# EAGLE design i2c_rgb_smd (EAGLE 5.04)
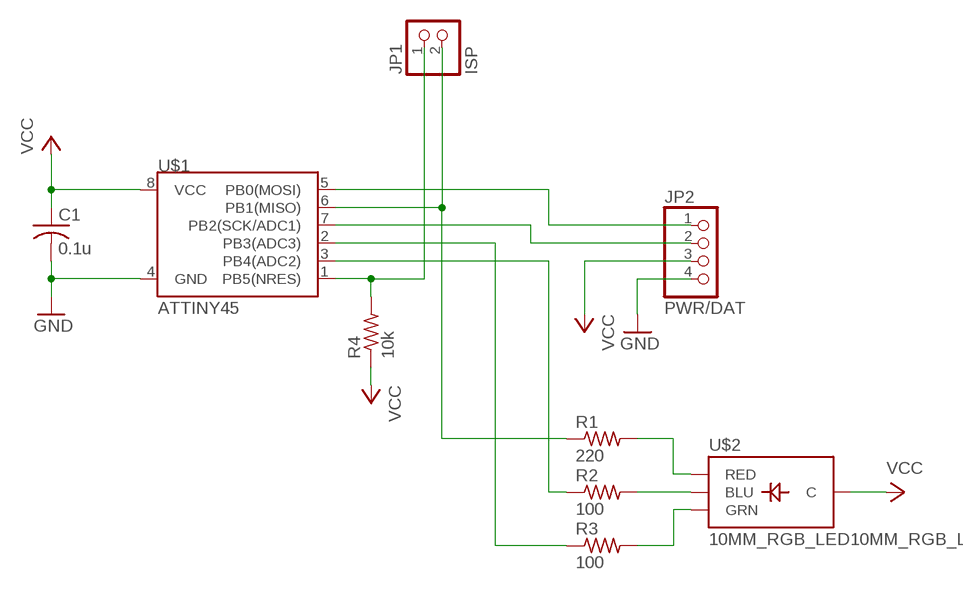
[diagram p0: schematic, sheet 1]

## Parts
C1  0.1u  C-USC0805  [C0805]
JP1  ISP  PINHD-1X2  [1X02]
JP2  PWR/DAT  PINHD-1X4  [1X04]
R1  220  R-US_R0805  [R0805]
R2  100  R-US_R0805  [R0805]
R3  100  R-US_R0805  [R0805]
R4  10k  R-US_R0805  [R0805]
U$1  ATTINY45  [SO08-EIAJ]
U$2  10MM_RGB_LED10MM_RGB_LED  [10MM_RGB_LED]

## Nets
GND [PWR]: C1.2 JP2.4 U$1.4(GND)
N$2: JP1.1 R4.2 U$1.1(PB5(NRES))
N$3: JP1.2 R1.1 U$1.6(PB1(MISO))
N$5: JP2.1 U$1.5(PB0(MOSI))
N$6: JP2.2 U$1.7(PB2(SCK/ADC1))
N$7: R1.2 U$2.RED
N$8: R2.2 U$2.BLU
N$9: R3.2 U$2.GRN
N$10: R2.1 U$1.3(PB4(ADC2))
N$11: R3.1 U$1.2(PB3(ADC3))
VCC [PWR]: C1.1 JP2.3 R4.1 U$1.8(VCC) U$2.COM(C)

## Library data of the parts
C1 = adafruit:C-US: CAPACITOR, American symbol
JP1 = pinhead:PINHD-1X2: PIN HEADER
JP2 = pinhead:PINHD-1X4: PIN HEADER
R1-R4 = adafruit:R-US_: RESISTOR, American symbol
U$1 = SparkFun:ATTINY45: Atmel ATTiny45
U$2 = 10mm_rgb_led:10MM_RGB_LED: 10mm Common Anode RGB LED Stocked by Evil Mad Scientist Labs

## Net classes
1 PWR: width 0.406 mm

## Board
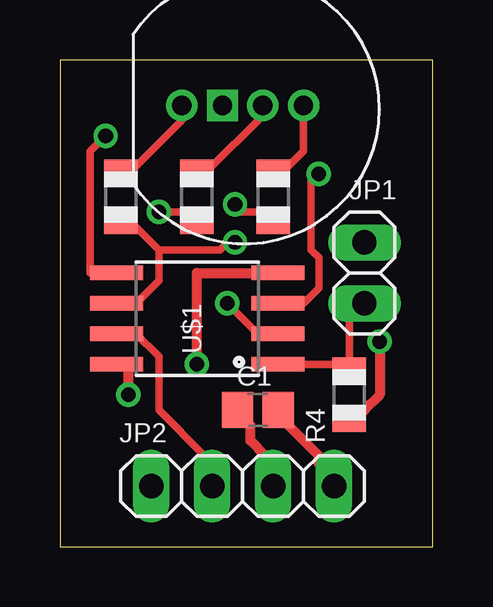
[diagram p1: board, top side]
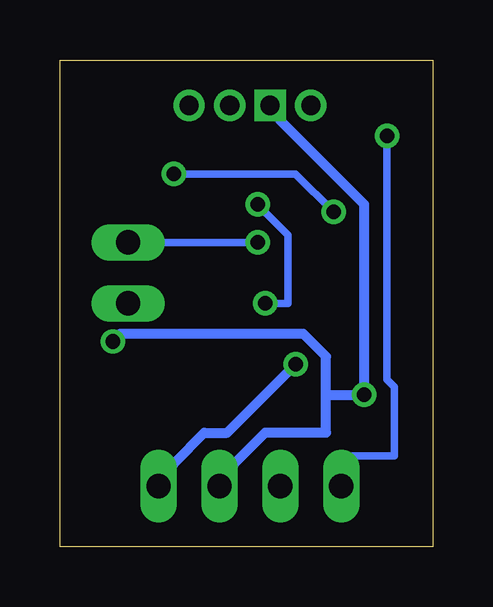
[diagram p2: board, bottom side, seen from below]

Size 15.54 x 20.31 mm. Coordinates in mm from the lower left corner, seen from the top.
Outline: 0,0 15.54,0 15.54,20.31 0,20.31 0,0
Copper layers (1*16): Top 0.035mm / dielectric 1.5mm / Bottom 0.035mm
Design rules "10mils *": minimum track width 12mil, minimum drill 24mil, track to track 12mil, track to pad 12mil, pad to pad 12mil, via to via 12mil, smd to smd 10mil, copper to edge 40mil, drill to drill 10mil, minimum pad ring 10mil, minimum via ring 8mil, stop-mask expansion 0mil, vias tented up to drill 0mil, thermal gap 10mil

### Footprints (pad centres in the part's own frame; a part is rotated, then mirrored left to right if it is on the bottom)
C0805 = smd 1.3 x 1.5: 1 -0.85,0; 2 0.85,0
1X02 = drill 1.016 long: 1 -1.27,0; 2 1.27,0
1X04 = drill 1.016 long: 1 -3.81,0; 2 -1.27,0; 3 1.27,0; 4 3.81,0
R0805 = smd 1.1 x 1.4: 1 -1,0; 2 1,0
SO08-EIAJ = smd 0.61 x 2.21: 1 -1.905,-3.378; 2 -0.635,-3.378; 3 0.635,-3.378; 4 1.905,-3.378; 5 1.905,3.353; 6 0.635,3.353; 7 -0.635,3.353; 8 -1.905,3.353
10MM_RGB_LED = drill 0.8 round: BLU 0.838,0; GRN 2.54,0; RED -2.54,0 | drill 0.8 square: COM -0.838,0

### Placement (x,y rotation side)
C1  8.26,5.71 0 top
JP1  12.7,11.43 90 top
JP2  7.62,2.54 0 top
R1  2.54,14.61 90 top
R2  5.71,14.61 90 top
R3  8.89,14.61 90 top
R4  12.06,6.35 90 top
U$1  5.71,9.53 90 top
U$2  7.62,18.41 0 top

### Tracks (layer width: path | path; a pad name or v marks a point on that pad's centre or on a via)
GND  (via drill 0.61)
  Top 0.406: C1.2 9.53,5.08 10.79,3.81 10.79,3.49 JP2.4 | v5.71,7.62 5.71,11.43 U$1.4
  Bottom 0.406: v5.71,7.62 8.57,4.76 9.53,4.76 10.79,3.49 JP2.4
N$2
  Top 0.305: U$1.1 11.43,7.62 R4.2 12.06,9.53 JP1.1
N$3  (via drill 0.61)
  Top 0.305: 4.13,12.38 3.17,13.34 R1.1 | 4.13,12.38 4.13,11.11 3.17,10.16 U$1.6 | v7.3,12.7 6.99,12.7 6.67,12.38 4.13,12.38
  Bottom 0.305: v7.3,12.7 JP1.2
N$5  (via drill 0.61)
  Top 0.305: v1.91,17.14 1.27,16.51 1.27,11.43 U$1.5
  Bottom 0.305: v1.91,17.14 1.91,6.99 1.59,6.67 1.59,3.81 3.49,3.81 JP2.1
N$6
  Top 0.305: U$1.7 3.17,8.89 4.13,7.94 4.13,5.71 6.03,3.81 JP2.2
N$7
  Top 0.305: R1.2 3.17,15.88 5.08,17.78 U$2.RED
N$8
  Top 0.305: R2.2 6.35,15.88 8.26,17.78 U$2.BLU
N$9
  Top 0.305: R3.2 9.53,15.88 10.16,16.51 U$2.GRN
N$10  (via drill 0.61)
  Top 0.305: v4.13,13.97 5.08,13.97 R2.1 | v10.79,15.56 10.48,15.24 10.48,12.38 10.79,12.06 10.79,10.79 10.16,10.16 U$1.3
  Bottom 0.305: v4.13,13.97 5.71,15.56 v10.79,15.56
N$11  (via drill 0.61)
  Top 0.305: v7.3,14.29 7.3,13.97 8.26,13.97 R3.1 | v6.99,10.16 8.26,8.89 U$1.2
  Bottom 0.305: v7.3,14.29 6.03,13.02 6.03,10.16 v6.99,10.16
VCC  (via drill 0.61)
  Top 0.406: v13.34,8.57 13.34,6.35 12.7,5.71 R4.1 | C1.1 7.94,5.08 7.94,4.45 8.57,3.81 JP2.3 | v2.86,6.35 2.86,7.62 U$1.8
  Bottom 0.406: v13.34,8.57 13.02,8.89 5.4,8.89 4.45,7.94 4.45,6.35 | 4.45,6.35 4.45,4.76 6.99,4.76 8.26,3.49 JP2.3 | 4.45,6.35 v2.86,6.35 2.86,14.29 6.35,17.78 U$2.COM